# EAGLE design 2019wimarc (EAGLE 7.2.0)
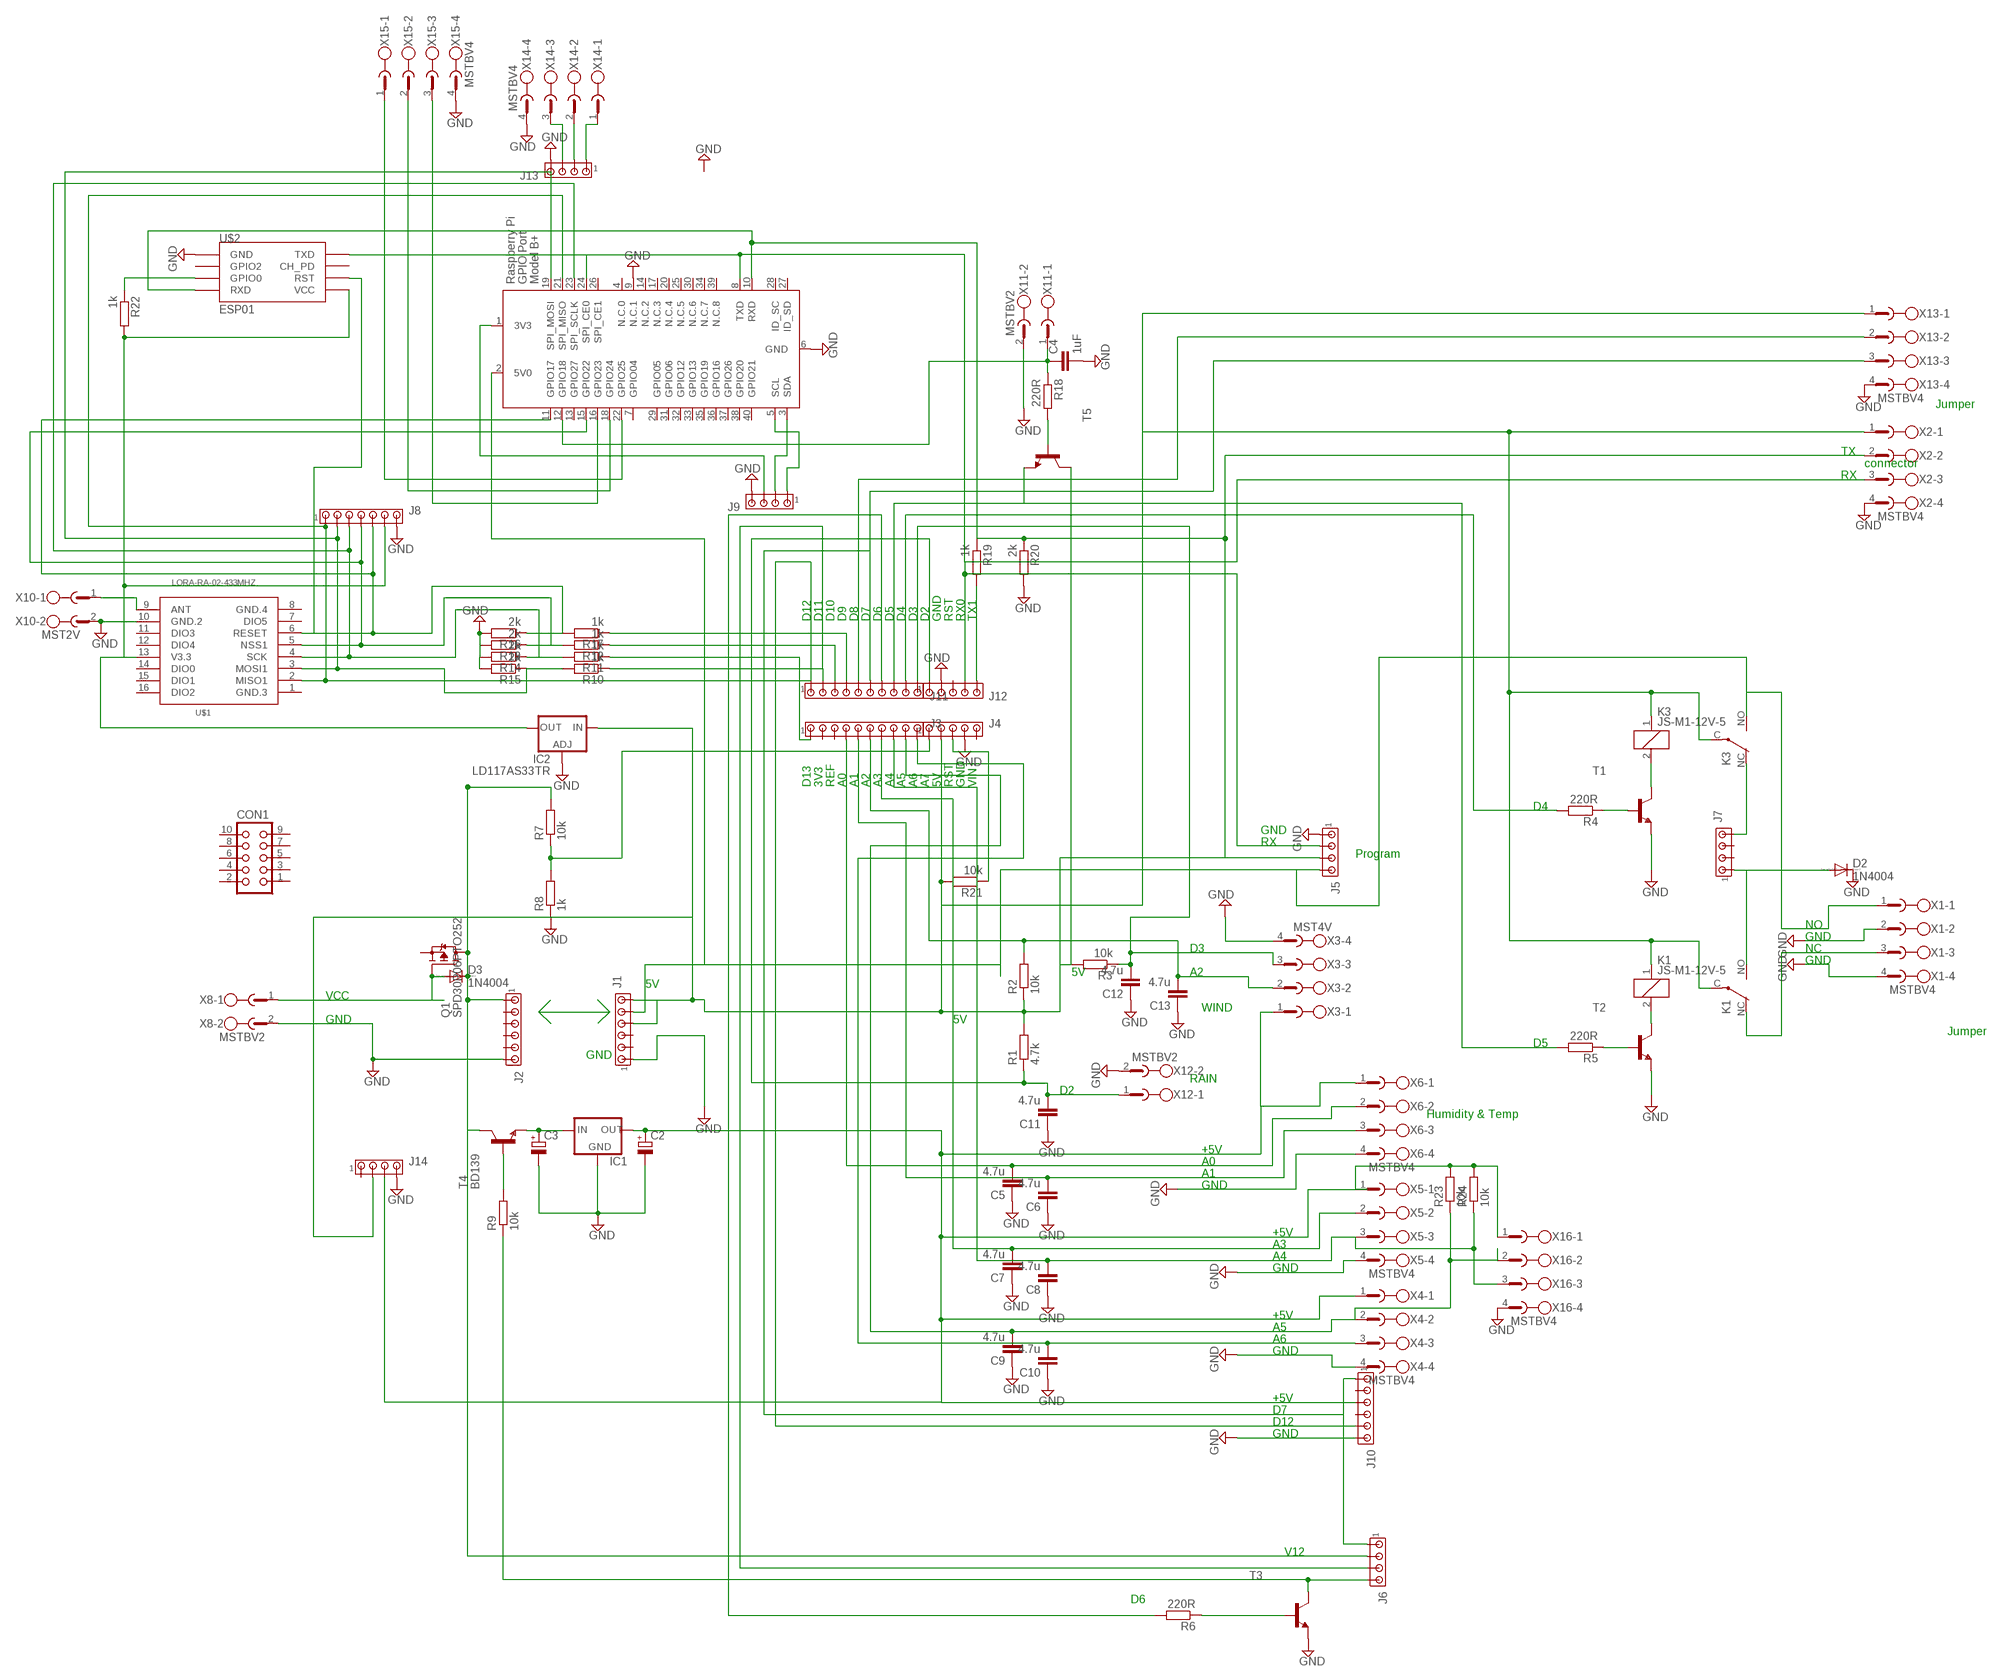
[diagram p0: schematic, sheet 1]

## Parts
C2  CPOL-EUE2.5-7  [E2,5-7]
C3  CPOL-EUE2.5-7  [E2,5-7]
C4  1uF  C-EUC0805K  [C0805K]
C5  4.7u  C-EUC0805K  [C0805K]
C6  4.7u  C-EUC0805K  [C0805K]
C7  4.7u  C-EUC0805K  [C0805K]
C8  4.7u  C-EUC0805K  [C0805K]
C9  4.7u  C-EUC0805K  [C0805K]
C10  4.7u  C-EUC0805K  [C0805K]
C11  4.7u  C-EUC0805K  [C0805K]
C12  4.7u  C-EUC0805K  [C0805K]
C13  4.7u  C-EUC0805K  [C0805K]
CON1  CON10  [CON10]
D2  1N4004  [DO41-10]
D3  1N4004  [DO41-10]
IC1  78XXL  [78XXL]
IC2  LD117AS33TR  [SOT223]
J1  MTA06-100  [10X06MTA]
J2  MTA06-100  [10X06MTA]
J3  MTA10-100  [10X10MTA]
J4  MTA05-100  [10X05MTA]
J5  MTA04-100  [10X04MTA]
J6  MTA04-100  [10X04MTA]
J7  MTA04-100  [10X04MTA]
J8  MTA07-100  [10X07MTA]
J9  MTA04-100  [10X04MTA]
J10  MTA06-100  [10X06MTA]
J11  MTA10-100  [10X10MTA]
J12  MTA05-100  [10X05MTA]
J13  MTA04-100  [10X04MTA]
J14  MTA04-100  [10X04MTA]
K1  JS-M1-12V-5  [JS-M]
K3  JS-M1-12V-5  [JS-M]
Q1  SPD30P06PTO252  [TO252]
R1  4.7k  R-EU_M0805  [M0805]
R2  10k  R-EU_M0805  [M0805]
R3  10k  R-EU_M0805  [M0805]
R4  220R  R-EU_M0805  [M0805]
R5  220R  R-EU_M0805  [M0805]
R6  220R  R-EU_M0805  [M0805]
R7  10k  R-EU_M0805  [M0805]
R8  1k  R-EU_M0805  [M0805]
R9  10k  R-EU_M0805  [M0805]
R10  1k  R-EU_M0805  [M0805]
R11  1k  R-EU_M0805  [M0805]
R12  1k  R-EU_M0805  [M0805]
R13  2k  R-EU_M0805  [M0805]
R14  2k  R-EU_M0805  [M0805]
R15  2k  R-EU_M0805  [M0805]
R16  2k  R-EU_M0805  [M0805]
R17  1k  R-EU_M0805  [M0805]
R18  220R  R-EU_M0805  [M0805]
R19  1k  R-EU_M0805  [M0805]
R20  2k  R-EU_M0805  [M0805]
R21  10k  R-EU_M0805  [M0805]
R22  1k  R-EU_M0805  [M0805]
R23  10k  R-EU_M0805  [M0805]
R24  10k  R-EU_M0805  [M0805]
T1  -NPN-SOT89-BCE  [SOT89-BCE]
T2  -NPN-SOT89-BCE  [SOT89-BCE]
T3  -NPN-SOT89-BCE  [SOT89-BCE]
T4  BD139  [TO126]
T5  -NPN-SOT89-BCE  [SOT89-BCE]
U$1  LORA-RA-02-433MHZ  [LORA-RA2-SMD]
U$2  ESP01  [ESP01]
X1  MSTBV4  [MSTBV4]
X2  MSTBV4  [MSTBV4]
X3  MST4V  [MSTBV4]
X4  MSTBV4  [MSTBV4]
X5  MSTBV4  [MSTBV4]
X6  MSTBV4  [MSTBV4]
X8  MSTBV2  [MSTBV2]
X9  RASPI_BOARD_B+_F  [RASPI_BOARD_B+_FULL]
X10  MST2V  [MSTBV2]
X11  MSTBV2  [MSTBV2]
X12  MSTBV2  [MSTBV2]
X13  MSTBV4  [MSTBV4]
X14  MSTBV4  [MSTBV4]
X15  MSTBV4  [MSTBV4]
X16  MSTBV4  [MSTBV4]

## Nets
GND: C2.- C3.- C4.2 C5.1 C6.1 C7.1 C8.1 C9.1 C10.1 C11.1 C12.1 C13.1 D2.C IC1.GND IC2.1(ADJ) J1.1 J2.6 J4.4 J5.1 J8.7 J9.4 J10.6 J12.2 J13.4 J14.4 R8.1 R13.2 R14.2 R15.2 R16.2 R20.2 T1.E T2.E T3.E U$1.10(GND.2) U$2.GND X1.2 X1.4 X2.4 X3.4 X4.4 X5.4 X6.4 X8.2 X9.6(GND) X9.9(N.C.1) X10.2 X11.2 X12.2 X13.4 X14.4 X15.4 X16.4
N$1: C5.2 J3.4 X6.2
N$2: C11.2 J12.1 R1.1 X12.1
N$3: C12.2 J11.10 R3.1 X3.3
N$4: C13.2 J3.6 R2.2 X3.2
N$5: J7.4 K3.NC(2:O)
N$6: J3.1 R11.1
N$7: D3.A Q1.1(G) X8.1
N$8: R19.1 R20.1 U$2.RX(RXD) X2.2 X9.10(RXD)
N$9: J5.2 J12.4 U$2.TX(TXD) X2.3 X9.8(TXD)
N$10: J13.1 X14.1
N$11: J11.3 R12.1
N$12: D3.C J2.1 J6.2 Q1.3(D) R7.2 T4.2(C)
N$13: C6.2 J3.5 X6.3
N$14: C7.2 J3.7 X5.2
N$15: C8.2 J3.8 R24.1 X5.3 X16.3
N$17: C10.2 J3.10 X4.3
N$18: J11.6 X13.3
N$19: J8.1 J10.5 J11.1 U$1.2(MISO1) X9.21(SPI_MISO)
N$20: K3.2 T1.C
N$21: X9.22(GPIO25) X15.1
N$22: R4.1 T1.B
N$23: K1.2 T2.C
N$24: R5.1 T2.B
N$25: K1.NC(2:O) X1.3
N$26: J6.4 R9.1 T3.C
N$28: C2.+ IC1.OUT J10.3 J14.3 R23.2 R24.2 X3.1 X4.1 X5.1 X6.1 X16.1
N$29: J4.1 R7.1 R8.2
N$30: R6.1 T3.B
N$31: J11.9 R4.2
N$32: J11.8 R5.2 T5.E
N$33: J11.7 R6.2
N$34: J6.1 J10.1
N$35: J8.3 R11.2 R14.1 U$1.4(SCK) X9.23(SPI_SCLK)
N$36: D2.A J7.1 K1.NO(2:S)
N$37: R18.2 T5.B
N$38: C3.+ IC1.IN T4.1(E)
N$39: R9.2 T4.3(B)
N$40: J11.5 X13.2
N$41: X9.18(GPIO24) X15.2
N$42: J8.5 R16.1 R17.2 U$1.6(RESET) U$2.RST X9.11(GPIO17)
N$44: J8.2 R10.2 R15.1 U$1.3(MOSI1) X9.19(SPI_MOSI)
N$45: J11.4 R17.1
N$46: C4.1 R18.1 X9.12(GPIO18) X11.1
N$47: U$1.9(ANT) X10.1
N$48: J8.4 R12.2 R13.1 U$1.5(NSS1) X9.15(GPIO22)
N$49: J12.5 R19.2
N$50: J4.3 R21.1
N$51: J9.2 X9.3(SDA)
N$52: J9.1 X9.5(SCL)
N$53: IC2.4(OUT) J8.6 R22.2 U$1.13(V3.3) U$2.VCC
N$54: IC2.3(IN) J1.4 J1.6 J4.2 J5.3 J14.2 K1.1 K1.C(2:P) K3.1 K3.C(2:P) R1.2 R2.1 R3.2 R21.2 T5.C X2.1 X13.1
N$55: J13.2 X14.2
N$56: J13.3 X14.3
N$57: X9.24(SPI_CE0)
N$59: X9.16(GPIO23) X15.3
N$61: J6.3 J11.2 R10.1
N$62: J9.3 X9.1(3V3)
N$63: R22.1 U$2.GPIO0
N$64: C9.2 J3.9 R23.1 X4.2 X16.2
N$70: J1.5 J5.4 K3.NO(2:S) X1.1 X9.2(5V0)
Unconnected: CON1.1 CON1.2 CON1.3 CON1.4 CON1.5 CON1.6 CON1.7 CON1.8 CON1.9 CON1.10 J1.2 J1.3 J2.2 J2.3 J2.4 J2.5 J3.2 J3.3 J4.5 J7.2 J7.3 J10.2 J10.4 J12.3 J14.1 Q1.2(S) U$1.7(DIO5) U$1.12(DIO4) U$1.14(DIO0) U$1.15(DIO1) U$1.16(DIO2) U$2.CH_PD U$2.GPIO2 X9.4(N.C.0) X9.7(GPIO04) X9.13(GPIO27) X9.14(N.C.2) X9.17(N.C.3) X9.20(N.C.4) X9.25(N.C.5) X9.26(SPI_CE1) X9.27(ID_SD) X9.28(ID_SC) X9.29(GPIO05) X9.30(N.C.6) X9.31(GPIO06) X9.32(GPIO12) X9.33(GPIO13) X9.34(N.C.7) X9.35(GPIO19) X9.36(GPIO16) X9.37(GPIO26) X9.38(GPIO20) X9.39(N.C.8) X9.40(GPIO21)

## Notes on the sheet
- Jumper
- TX
- connector
- RX
- D12 | D11 | D10 | D9 | D8 | D7 | D6 | D5 | D4 | D3 | D2 | GND | RST | RX0 | TX1
- D13 | 3V3 | REF | A0 | A1 | A2 | A3 | A4 | A5 | A6 | A7 | 5V | RST | GND | VIN
- D4
- GND
- RX
- Program
- NO
- GND
- D3 | NC
- GND
- 5V | A2
- 5V
- VCC
- WIND
- GND | 5V
- Jumper
- D5
- GND
- RAIN
- D2
- Humidity & Temp
- +5V
- A0
- A1
- GND
- +5V
- A3
- A4
- GND
- +5V
- A5
- A6
- GND
- +5V
- D7
- D12
- GND
- V12
- D6

## Power pins joined to a net without a drawn wire
DIO3: U$1.11(DIO3)
GND.3: U$1.1(GND.3)
GND.4: U$1.8(GND.4)

## Library data of the parts
C2 C3 = rcl:CPOL-EU: POLARIZED CAPACITOR, European symbol
C4-C13 = rcl:C-EU: CAPACITOR, European symbol
CON1 = con-harting:CON10: CONNECTOR; OC_FARNELL: unknown; OC_NEWARK: unknown
D2 D3 = diode:1N4004: DIODE general purpose rectifier, 1 A
IC1 = v-reg:78XXL: VOLTAGE REGULATOR
IC2 = v-reg:LD117A?*: Low drop fixed and adjustable positive voltage regulators 1 A Source: http://www.st.com/stonline/products/literature/ds/7194/ld1117axx.pdf
J1 J2 J10 = con-amp:MTA06-100: AMP connector Connection corrected 2014-09-19
J3 J11 = con-amp:MTA10-100: AMP connector
J4 J12 = con-amp:MTA05-100: AMP connector
J5-J7 J9 J13 J14 = con-amp:MTA04-100: AMP connector
J8 = con-amp:MTA07-100: AMP connector
K1 K3 = relay:JS-M1*: Automotive Ultra-Miniature Power Relay NAiS Source: http://www.mew-europe.com/.. en_ds_61211_0000.pdf
Q1 = transistor-fet:SPD30P06P: SIPMOS(R) Power-Transistor P-Channel, Enhancement mode Source: http://www.infineon.com/upload/Document/cmc_upload/documents/012/3615/SPD_U30P06P.pdf
R1-R24 = resistor:R-EU_: RESISTOR, European symbol
T1-T3 T5 = transistorSMD:*-NPN-: NPN Transistror BF959 corrected 2008.03.06
T4 = transistor-npn:BD139*: NPN Transistor
U$1 = LikeCircuit:LORA-RA-02-433MHZ: 433 MHz Lora Ra-02 Radio Transceiver Module based on SX1276 chip. Visit our more eagle PCB <https://www.likecircuit.com/>
U$2 = esp8266modules:ESP01: ESP8266 Wifi module 01
X1 X2 X4-X6 X13-X16 = con-phoenix-508:MSTBV4: PHOENIX; MPN: MSTBV 2,5/4-GF-5.08; OC_FARNELL: 1792794; OC_NEWARK: 69R9847
X3 = con-phoenix-508:MST4V: PHOENIX; OC_FARNELL: unknown; OC_NEWARK: unknown
X8 X11 X12 = con-phoenix-508:MSTBV2: PHOENIX; MPN: MSTBV 2,5/2-GF-5.08; OC_FARNELL: 1792792; OC_NEWARK: 69R9845
X9 = raspberrypi_bastelstube_v13:RASPI_BOARD_B+: Raspberry Pi GPIO connector with markings for the outer dimensions of the Raspberry Pi board model B+ with different sets of drill holes or mounting pads
X10 = con-phoenix-508:MST2V: PHOENIX; OC_FARNELL: unknown; OC_NEWARK: unknown

## Board
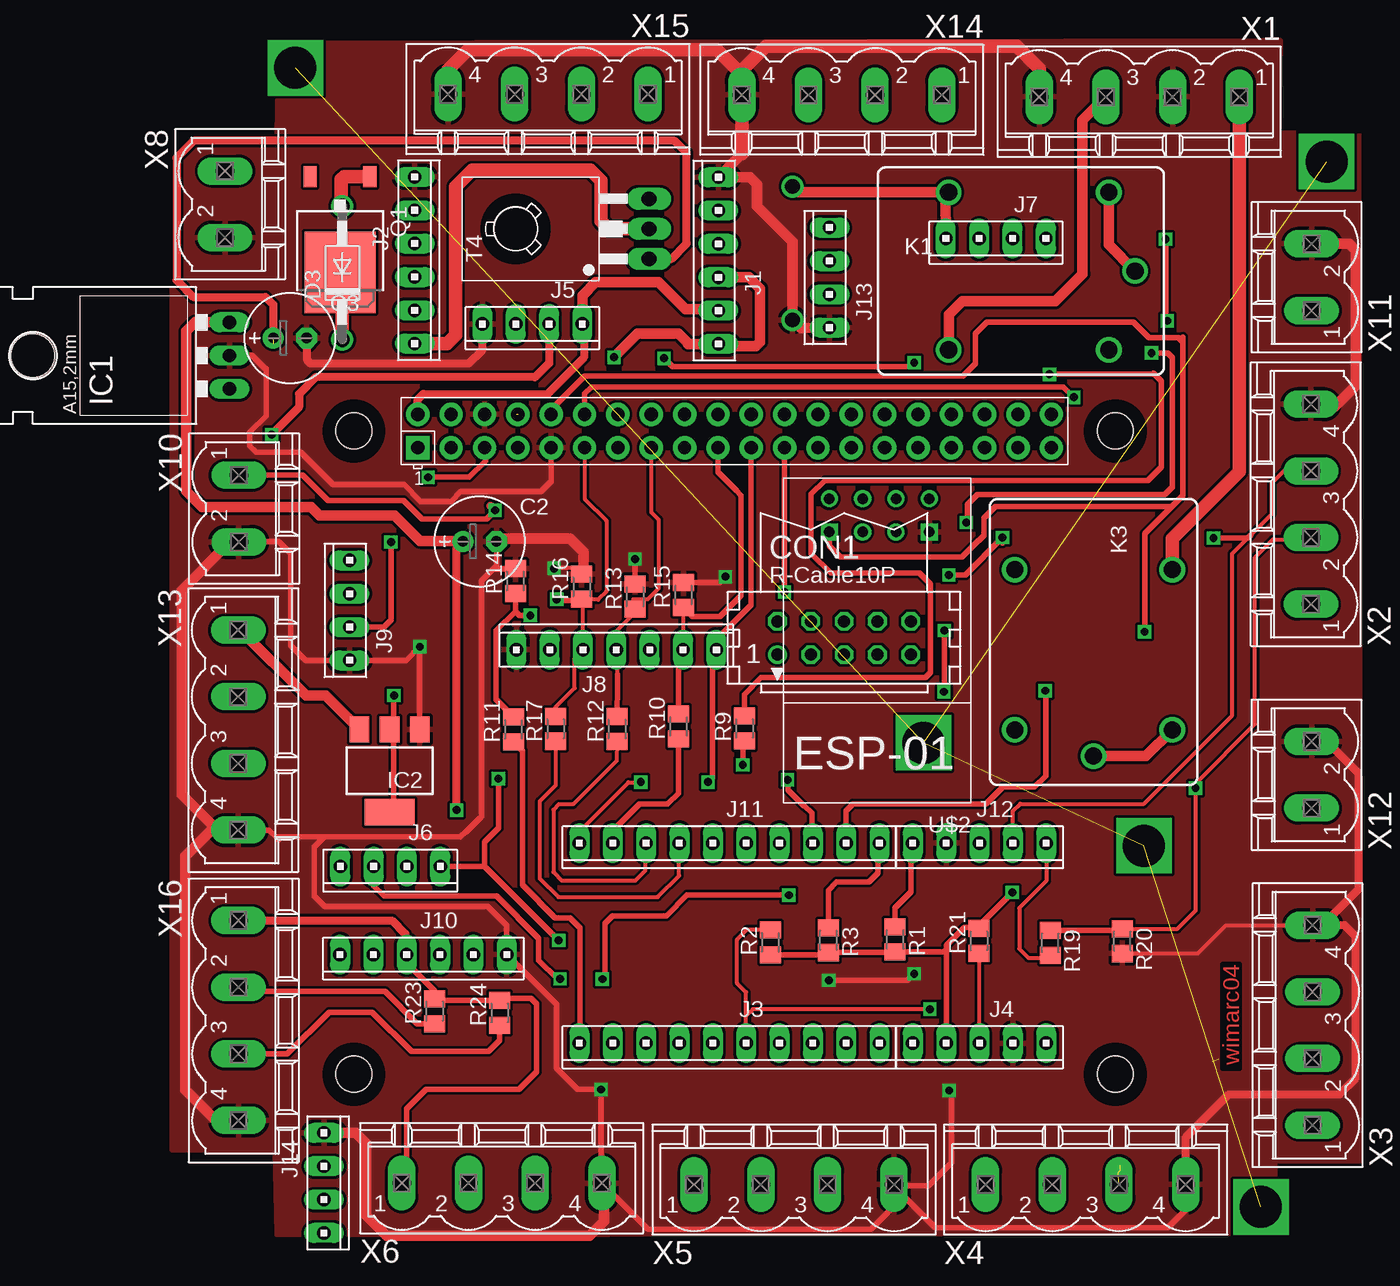
[diagram p1: board, top side]
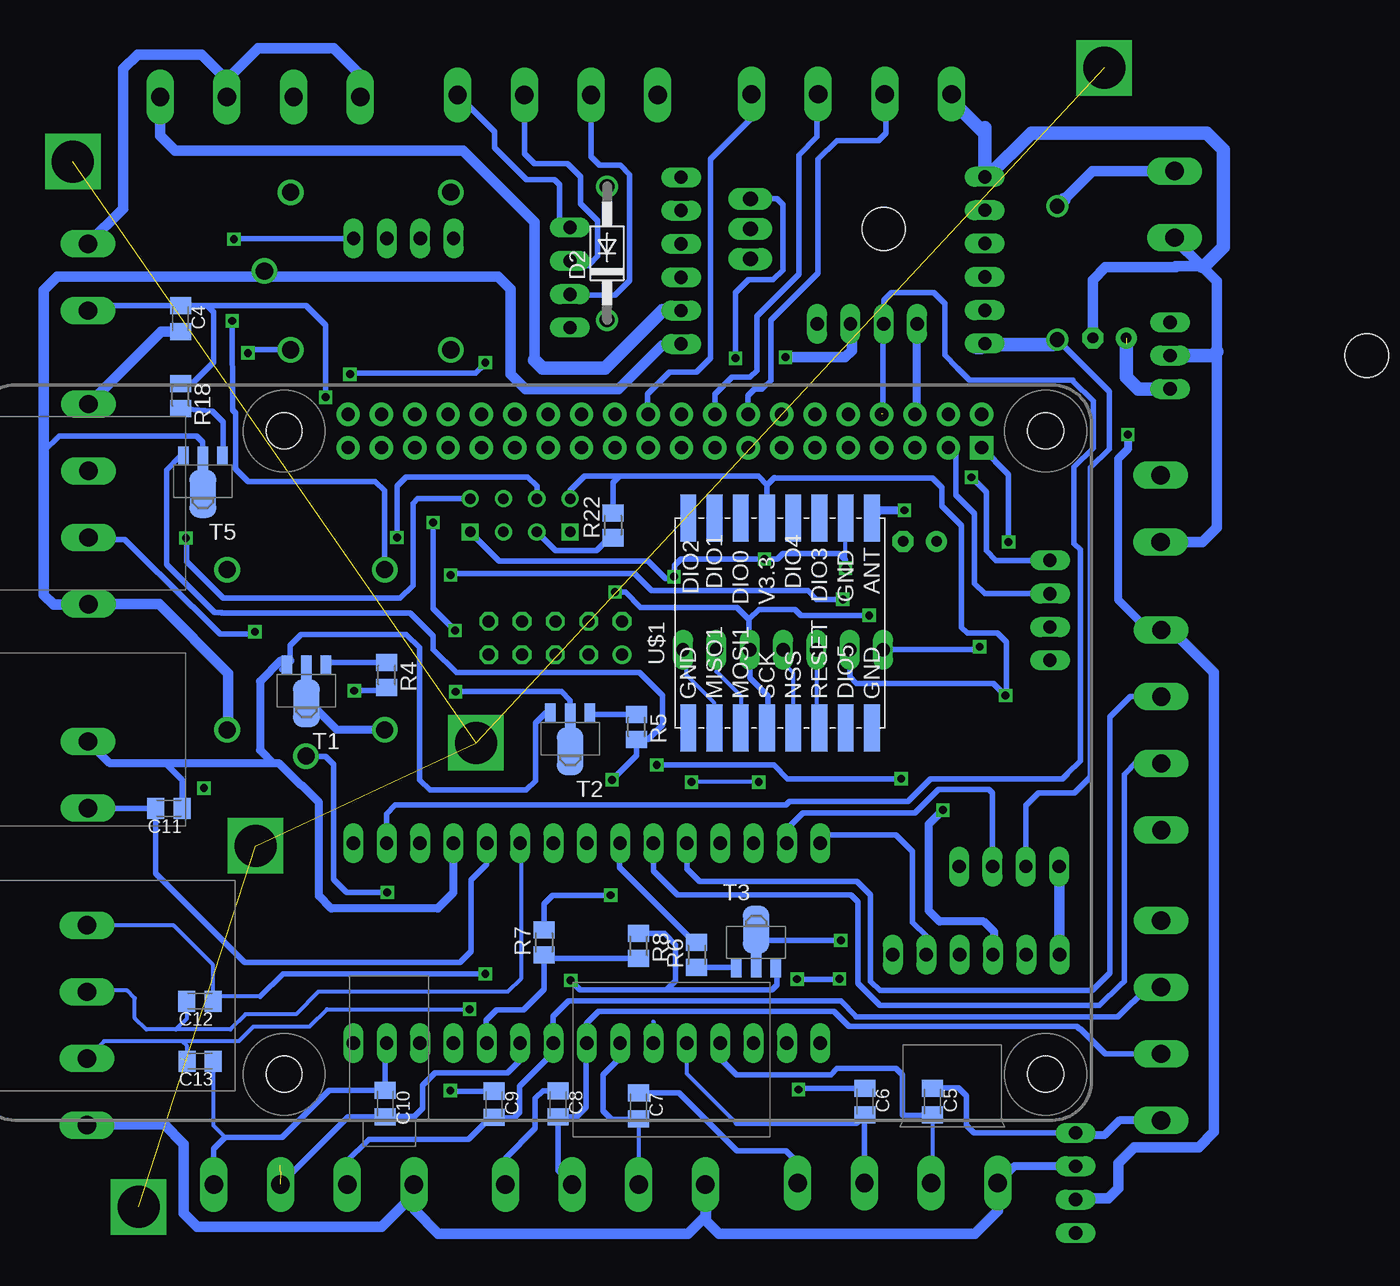
[diagram p2: board, bottom side, seen from below]

No outline drawn. Coordinates in mm, seen from the top.
Copper layers (1*16): Top 0.035mm / dielectric 1.5mm / Bottom 0.035mm
Design rules "default": minimum track width 10mil, minimum drill 24mil, track to track 8mil, track to pad 8mil, pad to pad 8mil, via to via 8mil, smd to smd 8mil, copper to edge 40mil, drill to drill 8mil, minimum pad ring 10mil, minimum via ring 8mil, stop-mask expansion 4mil, vias tented up to drill 0mil, thermal gap 10mil

### Footprints (pad centres in the part's own frame; a part is rotated, then mirrored left to right if it is on the bottom)
E2,5-7 = drill 0.813 pad 1.6: + -1.27,0 | drill 0.813 pad 1.6 octagon: - 1.27,0
C0805K = smd 1.3 x 1.6: 1 -1,0; 2 1,0
CON10 = drill 0.914: 1 -5.08,-1.27 | drill 0.914 octagon: 2 -5.08,1.27; 3 -2.54,-1.27; 4 -2.54,1.27; 5 0,-1.27; 6 0,1.27; 7 2.54,-1.27; 8 2.54,1.27; 9 5.08,-1.27; 10 5.08,1.27
DO41-10 = drill 1.118: A 5.08,0; C -5.08,0
78XXL = drill 1.016 long: GND 0,-3.81; IN -2.54,-3.81; OUT 2.54,-3.81 | hole 3.302: 0,11.176
SOT223 = smd 1.5 x 2: 1 -2.3,-3.15; 2 0,-3.15; 3 2.3,-3.15 | smd 3.8 x 2: 4 0,3.15
10X06MTA = drill 1.016 long: 1 6.35,0; 2 3.81,0; 3 1.27,0; 4 -1.27,0; 5 -3.81,0; 6 -6.35,0
10X10MTA = drill 1.016 long: 1 11.43,0; 2 8.89,0; 3 6.35,0; 4 3.81,0; 5 1.27,0; 6 -1.27,0; 7 -3.81,0; 8 -6.35,0; 9 -8.89,0; 10 -11.43,0
10X05MTA = drill 1.016 long: 1 5.08,0; 2 2.54,0; 3 0,0; 4 -2.54,0; 5 -5.08,0
10X04MTA = drill 1.016 long: 1 3.81,0; 2 1.27,0; 3 -1.27,0; 4 -3.81,0
10X07MTA = drill 1.016 long: 1 7.62,0; 2 5.08,0; 3 2.54,0; 4 0,0; 5 -2.54,0; 6 -5.08,0; 7 -7.62,0
JS-M = drill 1.3: 1 6.7,6; 2 6.7,-6; C 8.7,0; NC -5.5,-6; NO -5.5,6
TO252 = smd 1 x 1.6: 1 -2.28,-4.8; 2 2.28,-4.8 | smd 5.4 x 6.2: 3 0,2.5
M0805 = smd 1.3 x 1.6: 1 -0.95,0; 2 0.95,0
SOT89-BCE = smd 0.8 x 1.4: B -1.499,-1.981; E 1.499,-1.981 | smd 0.8 x 1.9: C 0,-1.727 | smd 2.032 x 3.65: C@1 0,0.94
TO126 = drill 1.118 long: 1 -2.286,-5.08; 2 0,-5.08; 3 2.286,-5.08 | hole 3.302: 0,5.08
LORA-RA2-SMD = smd 3.6 x 1.2: 1 -8,7; 2 -8,5; 3 -8,3; 4 -8,1; 5 -8,-1; 6 -8,-3; 7 -8,-5; 8 -8,-7; 9 8,-7; 10 8,-5; 11 8,-3; 12 8,-1; 13 8,1; 14 8,3; 15 8,5; 16 8,7
ESP01 = drill 0.8: CH_PD -1.285,-8.178; GPIO0 1.255,-5.638; GPIO2 -1.285,-5.638; RST 1.255,-8.178; TX -3.825,-8.178; VCC 3.795,-8.178 | drill 0.8 square: GND -3.825,-5.638; RX 3.795,-5.638
MSTBV4 = drill 1.397 long: 1 -7.62,0; 2 -2.54,0; 3 2.54,0; 4 7.62,0
MSTBV2 = drill 1.397 long: 1 -2.54,0; 2 2.54,0
RASPI_BOARD_B+_FULL = drill 1 pad 1.778 square: 1 8.37,51.23 | drill 1 pad 1.778: 2 8.37,53.77; 3 10.91,51.23; 4 10.91,53.77; 5 13.45,51.23; 6 13.45,53.77; 7 15.99,51.23; 8 15.99,53.77; 9 18.53,51.23; 10 18.53,53.77; 11 21.07,51.23; 12 21.07,53.77; 13 23.61,51.23; 14 23.61,53.77; 15 26.15,51.23; 16 26.15,53.77; 17 28.69,51.23; 18 28.69,53.77; 19 31.23,51.23; 20 31.23,53.77; 21 33.77,51.23; 22 33.77,53.77; 23 36.31,51.23; 24 36.31,53.77; 25 38.85,51.23; 26 38.85,53.77; 27 41.39,51.23; 28 41.39,53.77; 29 43.93,51.23; 30 43.93,53.77; 31 46.47,51.23; 32 46.47,53.77; 33 49.01,51.23; 34 49.01,53.77; 35 51.55,51.23; 36 51.55,53.77; 37 54.09,51.23; 38 54.09,53.77; 39 56.63,51.23; 40 56.63,53.77 | hole 2.75: 3.5,3.5; 3.5,52.5; 61.5,3.5; 61.5,52.5

### Placement (x,y rotation side)
C2  24.43,59.13 0 top
C3  9.98,74.63 0 top
C4  80.75,76.1 270 bottom
C5  23.47,16.46 270 bottom
C6  28.63,16.46 270 bottom
C7  45.87,16.13 270 bottom
C8  51.99,16.28 270 bottom
C9  56.87,16.26 270 bottom
C10  65.15,16.31 270 bottom
C11  81.64,38.79 180 bottom
C12  79.27,24.1 180 bottom
C13  79.25,19.53 180 bottom
CON1  52.2,51.77 0 top
D2  48.26,81.08 90 bottom
D3  13.97,79.58 90 top
IC1  1.57,73.28 90 top
IC2  17.58,41.66 180 top
J1  42.62,80.52 90 top
J2  19.48,80.54 270 top
J3  43.46,20.9 180 top
J4  62.51,20.9 180 top
J5  28.45,75.68 180 top
J6  17.63,34.37 180 top
J7  63.75,82.19 180 top
J8  34.85,50.88 0 top
J9  14.53,53.87 90 top
J10  20.14,27.66 180 top
J11  43.46,36.14 180 top
J12  62.51,36.14 180 top
J13  51.08,79.22 90 top
J14  12.57,10.26 270 top
K1  65.66,79.72 0 top
K3  71.19,51.47 270 top
Q1  13.79,82.12 180 top
R1  56.08,28.81 270 top
R2  46.57,28.59 90 top
R3  51,28.75 270 top
R4  65.04,48.95 270 bottom
R5  46.01,45 270 bottom
R6  41.43,27.62 90 bottom
R7  53.06,28.57 90 bottom
R8  45.85,28.32 270 bottom
R9  44.6,44.88 90 top
R10  39.57,45.03 90 top
R11  27,44.81 90 top
R12  34.9,44.83 90 top
R13  36.27,54.91 90 top
R14  27.15,56.11 90 top
R15  39.95,55.04 90 top
R16  32.21,55.68 90 top
R17  30.23,44.86 90 top
R18  80.75,70.18 270 bottom
R19  67.89,28.55 270 top
R20  73.38,28.68 270 top
R21  62.46,28.7 90 top
R22  47.8,60.35 90 bottom
R23  21.01,23.34 90 top
R24  25.96,23.22 90 top
T1  71.16,47.74 180 bottom
T2  51.07,44.09 180 bottom
T3  36.91,28.6 0 bottom
T4  32.26,82.93 90 top
T5  79.04,63.68 180 bottom
U$1  35.08,52.91 90 bottom
U$2  54.86,54.2 180 top
X1  74.68,92.98 180 top
X2  87.75,61.96 90 top
X3  87.88,22.28 90 top
X4  70.59,10.15 0 top
X5  48.39,10.15 0 top
X6  26.12,10.25 0 top
X8  5.04,84.8 270 top
X9  11.35,15.04 0 top
X10  6.1,61.62 270 top
X11  87.81,79.25 90 top
X12  87.81,41.35 90 top
X13  6.05,44.75 270 top
X14  52.02,93.14 180 top
X15  29.64,93.19 180 top
X16  6.07,22.63 270 top

### Tracks (layer width: path | path; a pad name or v marks a point on that pad's centre or on a via)
GND  (via drill 0.6)
  Top 0.305: R20.2 79.14,27.73 81.28,29.87 87.86,29.87 X3.4 87.78,30 | 32.36,57.08 30.11,57.08 v30.1,57.07
  Top 0.406: IC2.1 v19.88,51.1 | 27.04,56.95 27.12,57.02 | v19.88,51.1 18.84,50.06 J9.4 11.18,50.06 10.03,51.21 10.03,58.19 9.12,59.11 6.12,59.11 X10.2 | 27.12,57.02 R14.2 | 65.15,20.8 J4.4 | v60.2,17.3 60.35,17.14 60.35,11.81 58.6,10.06 56.1,10.06 X5.4 56.01,8.48 54.25,6.73 37.26,6.73 X6.4 33.68,10.31 v33.68,17.37 33.66,17.4 31.88,17.4 30.3,18.97 30.3,23.85 J10.6 26.49,29.87 25.04,31.32 12.62,31.32 11.84,32.11 11.84,35.84 12.6,36.6 | v51.03,25.68 57.02,25.68 v57.53,26.19 | 19.89,51.12 v19.88,51.1 | 9.12,36.4 8.91,36.6 | 5.74,37.11 5.74,37.19 5.82,37.11 8.41,37.11 8.91,36.6 | 27.12,57.02 25.45,57.02 | 25.45,57.02 24.56,56.13 24.56,38.18 23.39,37.01 23.37,37.01 22.96,36.6 12.6,36.6 | 12.6,36.6 8.91,36.6 | X5.4 56.01,10.01 59.16,6.86 76.86,6.86 78.28,8.28 78.28,10.08 X4.4 | C2.- 25.7,57.28 25.45,57.02 | 32.36,57.08 R16.2 | R15.2 42.71,55.99 v43.16,56.44 | R13.2 v36.27,57.78 | X9.9 29.88,63.69 29.11,62.92 22.99,62.92 22.25,62.18 19.94,62.18 18.67,63.45 13.26,63.45 10.79,65.91 7.39,65.91 6.93,66.37 6.93,67.44 8.18,68.68 8.18,72.29 8.08,72.29 7.06,73.3 5.41,73.3 IC1.GND
  Top 0.61: 24.64,74.78 J5.1 24.64,73.71 23.6,72.67 11.56,72.67 11.3,72.92 11.3,74.57 C3.- | X4.4 78.21,13.72 81.48,16.99 89.92,16.99 91.16,18.24 91.16,29.06 90.32,29.9 X3.4 | 87.78,30 88.75,30 91.39,32.64 91.39,41.45 89.1,43.74 87.96,43.74 X12.2
  Top 0.813: 87.76,69.57 X2.4 87.94,69.39 89.59,69.39 91.19,70.99 91.19,81.28 90.68,81.79 X11.2 | 44.4,88.65 J1.1 45.03,86.87 45.57,86.33 45.57,84.66 48.26,81.97 D2.C 48.9,75.36 J13.4 | J14.4 14.99,14.07 15.77,13.28 15.77,7.8 17.35,6.22 32.79,6.22 33.91,7.34 33.91,10.08 X6.4 | X13.4 4.01,37.13 2.01,35.13 2.01,17.35 4.7,14.66 5.71,14.66 X16.4 | 5.74,37.11 4.47,37.11 1.73,39.85 1.73,55.4 5.41,59.08 X10.2 | 32.36,57.08 32.36,58.32 31.32,59.36 25.93,59.36 C2.-
  Top 1.016: 44.4,94.69 X14.4 44.4,88.65 | 44.4,94.69 44.4,95.02 46.23,96.85 65.35,96.85 67.06,95.15 X1.4 | X15.4 22.02,95.07 23.55,96.6 42.49,96.6 44.4,94.69
  Bottom 0.305: 74.68,24.46 77.92,24.46 C12.1 78.27,26.86 81.28,29.87 87.86,29.87 X3.4 | 77.35,13.74 78.25,14.64 C13.1 | v30.1,57.07 30.1,57.71 30.1,60.89 U$1.10
  Bottom 0.406: J8.7 20.11,50.88 v19.88,51.1 | T1.E 73,49.38 73.05,49.38 72.39,50.04 72.39,51.21 71.55,52.05 63.55,52.05 62.53,51.03 62.53,40.97 61.75,40.18 54.43,40.18 53.72,40.89 53.72,45.31 52.96,46.08 T2.E | 43.71,24.97 50.32,24.97 v51.03,25.68 | C6.1 33.59,17.46 v33.68,17.37 | C8.1 53.15,17.28 53.75,16.69 53.75,14.4 56.01,12.14 X5.4 | J4.4 65.15,20.8 C10.1 69.43,17.31 73,13.74 77.35,13.74 78.21,12.88 X4.4 | C9.1 60.16,17.26 v60.2,17.3 | C7.1 42.78,17.13 38.35,12.7 34.62,12.7 33.68,11.76 33.68,10.31 X6.4 | C5.1 23.43,17.5 21.49,17.5 20.88,16.89 20.88,14.63 20.32,14.07 J14.4 | v57.53,26.19 72.95,26.19 74.68,24.46 | R8.1 43.9,29.27 43.03,28.4 43.03,25.65 43.71,24.97 | 43.71,24.97 35.71,24.97 35.33,25.35 35.33,26.54 T3.E | 1.93,76.1 1.83,76.2 | 24.64,68.97 X9.6 | C11.1 80.64,40.96 81.89,42.22 | U$2.GND 56.48,57.63 45.14,57.63 43.81,56.31 43.28,56.31 v43.16,56.44 43.1,56.49 43.1,57.3 42.62,57.78 v36.27,57.78 35.28,57.78 34.85,58.22 30.61,58.22 30.1,57.71
  Bottom 0.61: 73.69,42.22 73.25,42.22 71.58,40.54 71.5,40.54 70.21,39.24 70.21,32.11 69.27,31.17 61.16,31.17 59.97,32.36 J12.2 | 73.69,42.22 81.89,42.22 86.13,42.22 X12.2 | 72.39,50.04 73.13,50.04 74.7,48.46 74.7,43.23 73.69,42.22 | X16.4 9.25,15.01 10.36,13.89 12.39,13.89 J14.4 | 24.64,68.97 J5.1
  Bottom 0.813: C4.2 82.23,75.1 X2.4 | 2.97,80.09 1.83,78.94 1.83,76.2 1.83,73.58 1.83,60.17 2.92,59.08 X10.2 | X1.2 77.22,94.31 | 77.22,94.31 79.12,96.22 84.02,96.22 85.11,95.12 85.11,84.48 X11.2 | X1.4 67.06,94.67 69.09,96.7 74.83,96.7 77.22,94.31 | C3.- 11.25,79.05 10.29,80.01 4.93,80.01 4.93,80.09 2.97,80.09 | X8.2 5.04,82.15 2.97,80.09
  Bottom 1.016: 19.48,90.19 J2.6 19.28,86.89 15.95,90.22 2.59,90.22 1.32,88.95 1.32,81.53 2.77,80.09 2.97,80.09 | 19.48,90.19 19.48,90.65 | X15.4 22.02,92.73 19.48,90.19 | IC1.GND 2.13,73.28 1.83,73.58
  other vias: 56.01,10.15
  pour Top: 9.09,97.08 83.9,97.26 85.42,97.26 85.29,90.27 91.39,90.12 91.54,11.96 85.22,11.94 85.22,12.22 85.01,12.22 84.96,6.43 9.02,6.3 8.86,12.8 1.02,12.8 1.02,90.2 9.02,90.2 9.12,95.45
N$1  (via drill 0.6)
  Top 0.305: v23.47,10.36 X6.2
  Bottom 0.305: C5.2 v23.47,10.36
  Bottom 0.406: J3.4 39.65,19.74 38.41,18.49 31.22,18.49 30.73,18.97 26.24,18.97 25.76,18.49 25.76,15.44 25.73,15.42 23.43,15.42 C5.2
N$2  (via drill 0.6)
  Top 0.305: v87.78,38.79 X12.1
  Top 0.406: R1.1 56.08,31.19 57.3,32.41 57.3,36.02 J12.1
  Bottom 0.305: X12.1 87.05,38.81
  Bottom 0.406: J12.1 57.43,34.52 58.6,33.35 58.6,27.89 59.44,27.05 75.87,27.05 82.65,33.83 82.65,38.77 C11.2 v87.78,38.79
N$3
  Top 0.305: 54.84,36.09 J11.10 | 87.83,24.87 X3.3
  Top 0.406: R3.1 51,32.56 51.61,33.17 54.1,33.17 54.79,33.86 54.79,36.04 J11.10 | 87.66,24.59 X3.3
  Bottom 0.305: J11.10 54.79,36.04 54.79,25.86 55.8,24.84 55.8,24.82 70.26,24.82 71.96,23.11 75.79,23.11 76.96,21.95 81.1,21.95 | 87.83,24.87 X3.3 87.78,24.92 84.81,24.92 84.23,24.33 84.23,22.81 83.36,21.95 81.1,21.95 | C12.2 80.27,22.77 81.1,21.95
N$4  (via drill 0.6)  (1 unrouted)
  Top 0.305: J3.6 44.73,22.99 | 44.73,22.99 44.73,24.79 44.04,25.48 44.04,28.8 44.81,29.57 46.55,29.57 R2.2 | v58.73,23.5 45.24,23.5 44.73,22.99
  Bottom 0.305: 44.73,22.55 J3.6 | 80.72,19.71 80.75,19.74 | v58.73,23.5 69.6,23.5 70.94,22.15 75.21,22.15 76.3,21.06 80.62,21.06 | 80.62,21.06 86.56,21.06 X3.2 | C13.2 80.25,20.68 80.62,21.06
N$5  (via drill 0.6)
  Top 0.406: v76.68,82.14 76.71,76.02 v76.81,75.92
  Bottom 0.406: J7.4 76.63,82.19 v76.68,82.14 | v76.81,75.92 76.78,69.14 76.53,68.89 76.53,64.64 75.59,63.7 65.91,63.7 65.22,63.01 65.22,56.95 K3.NC
N$6
  Top 0.305: 32,20.93 J3.1
  Top 0.406: 31.98,20.95 J3.1 32.08,20.95 32.08,29.69 31.32,30.45 30.18,30.45 27.69,32.94 27.69,43.17 R11.1
N$7
  Top 1.016: Q1.1 14.1,86.92 13.89,86.72 13.89,84.73 D3.A
  Bottom 0.813: X8.1 11.28,87.34 D3.A
  Bottom 1.016: 13.47,85.16 D3.A
N$8  (via drill 0.6)
  Top 0.305: R20.1 77.58,29.63 78.97,31.01 78.97,40.28 | X2.2 87.61,59.28 84.86,59.28 83.49,57.91 83.49,45.21 78.97,40.69 v78.97,40.34
  Top 0.406: v78.97,40.34 78.97,40.28 | R19.1 73.25,29.5 R20.1 | 77.14,61.8 77.98,62.64 77.98,74.32 | 77.14,61.8 75.08,59.74 v75.08,52.25 74.98,52.35 | 77.98,74.7 77.98,74.32 | 77.98,74.32 77.65,74.65 75.39,74.65 74.22,75.82 71.55,75.82 71.53,75.84 63.07,75.84 62.18,74.95 62.18,72.67 61.24,71.73 32.44,71.73 29.88,69.18 X9.10 | U$2.RX 51.07,58.79 51.92,57.94 61.16,57.94 62.43,59.21 62.46,59.21 62.84,59.59 62.84,60.91 63.73,61.8 77.14,61.8
  Bottom 0.406: 78.92,40.28 v78.97,40.34 | X2.2 87.61,59.28 84.99,59.28 79.86,54.15 79.81,54.15 77.72,52.07 75.26,52.07 v75.08,52.25 | 29.72,68.97 X9.10
N$9  (via drill 0.6)  (1 unrouted)
  Top 0.305: J12.4 65.05,38.58 65.61,39.14 75.03,39.14 81.76,45.87 81.76,58.19 83.19,59.61 84.78,61.21 84.78,63.58 85.85,64.64 87.61,64.64 X2.3 87.76,64.52 88.49,64.52
  Top 0.406: v80.34,59.38 82.96,59.38 83.19,59.61
  Bottom 0.406: J12.4 65.05,38.38 64.39,39.04 34.65,39.04 34.37,39.32 25.32,39.32 23.62,41.02 13.56,41.02 13.18,41.4 13.18,41.45 12.22,42.42 12.22,58.5 12.7,58.98 12.7,64.77 11.23,66.24 11.23,69.8 12.78,71.35 12.78,71.42 20.68,71.42 21.57,72.31 21.57,72.34 22.53,73.3 22.53,77.24 23.37,78.08 26.59,78.08 27.18,77.49 J5.2 27.25,75.61 27.25,68.81 | J12.4 65.05,35.74 65.15,35.64 65.15,36.04 J12.4 | U$2.TX 62.69,62.38 63.04,62.03 63.04,55.78 64.01,54.81 77.5,54.81 80.29,57.61 80.29,59.33 v80.34,59.38
N$10
  Bottom 0.406: J13.1 51.87,83.01 51.87,86.31 52.25,86.69 54.41,86.69 56.84,89.13 56.84,90.35 X14.1
N$11
  Top 0.305: J11.3 37.06,36.09 37.06,34.06 36.3,33.3 30.68,33.3 30.05,33.93 30.05,38.68 30.45,39.09 31.55,39.09 34.87,42.42 R12.1
N$12  (via drill 0.6)
  Top 0.406: v47.98,32.18 40.23,32.18 38.66,30.61 34.54,30.61 33.98,30.05 33.98,25.98 v33.78,25.78 | v30.56,25.81 30.35,25.81 28.93,27.23 28.93,28.91 25.73,32.11 23.44,32.11 22.99,32.11 17.14,32.11 16.36,32.89 J6.2
  Top 1.016: J2.1 21.97,74.19 22.61,74.83 22.61,86.13 23.88,87.4 32.87,87.4 33.68,86.59 33.68,83.52 34.24,82.96 37.31,82.96 T4.2 37.29,82.98 | D3.C 13.97,79.44 Q1.3
  Bottom 0.406: 11.48,41.17 11.48,41.15 | 11.48,41.15 12.68,39.95 15.42,39.95 16.36,39.01 J6.2 | 11.48,41.15 11.43,41.2 11.43,64.75 10.01,66.17 10.01,70.54 D3.C | R7.2 53.06,31.52 52.43,32.16 48.01,32.16 v47.98,32.18 | v33.78,25.78 30.58,25.78 v30.56,25.81
  Bottom 1.016: J2.1 19.79,73.89 20.09,73.89 19.86,74.12 14.35,74.12 D3.C
N$13
  Top 0.305: 28.63,10.28 X6.3
  Bottom 0.305: J3.5 42.19,18.59 38.41,14.81 | 28.57,10.34 X6.3
  Bottom 0.406: 38.41,14.81 29.28,14.81 C6.2 28.63,15.34 28.65,15.32 X6.3
N$14  (via drill 0.6)
  Top 0.305: v45.87,10.17 X5.2
  Bottom 0.305: C7.2 v45.87,10.17
  Bottom 0.406: J3.7 47.27,19.79 48.56,18.49 48.56,15.75 47.93,15.11 45.89,15.11 C7.2
N$15
  Top 0.406: R24.1 25.96,21.11 25.12,20.27 19.25,20.27 16.26,23.27 12.95,23.27 9.78,20.09 X16.3
  Bottom 0.406: X16.3 10.31,20.09 12.22,22 12.29,22 12.47,22.17 29.82,22.17 30.99,23.34 48.92,23.34 49.84,22.43 49.84,20.93 J3.8 49.86,20.85 49.86,16 50.58,15.28 C8.2 51.99,11.21 X5.3
N$17  (3 unrouted)
  Bottom 0.406: J3.10 54.89,19.61 55.85,18.64 61.34,18.64 62.31,17.68 62.31,15.95 62.92,15.34 65.12,15.34 C10.2 68,15.28 X4.3
N$18
  Bottom 0.406: J11.6 44.73,34.04 42.88,32.18 29.67,32.18 29.16,31.67 29.16,25.45 27.48,23.77 10.74,23.77 9.17,25.35 9.14,25.35 8.87,25.63 8.87,41.38 7.85,42.39 6.22,42.39 X13.3
N$19  (via drill 0.6)
  Top 0.305: J11.1 32.03,37.03 35.76,40.77 36.68,40.77 v36.7,40.79 | 42.6,50.75 J8.1 42.16,50.57
  Top 0.406: 45.14,66.25 X9.21 45.11,66.25 45.11,54.28 42.47,51.64 J8.1 | 42.16,50.57 42.16,41.12 v41.83,40.79
  Bottom 0.305: v36.7,40.79 v41.83,40.79 | U$1.2 40.08,46.81 42.22,48.95 42.22,50.62 J8.1
  Bottom 0.406: 31.52,36.65 J11.1 31.42,36.75 26.24,36.75 24.99,35.51 24.99,30.12 23.95,29.08 J10.5
N$20
  Bottom 0.61: K3.2 68.82,44.77 71.14,47.09 71.14,49.45 T1.C
N$21
  Bottom 0.406: X15.1 37.26,91.36 40.39,88.24 40.39,73.1 41.45,72.03 43.48,72.03 45.16,70.36 45.16,68.84 X9.22
N$22
  Bottom 0.406: R4.1 69.48,49.9 T1.B
N$23  (via drill 0.6)
  Top 0.406: v75.62,73.48 76.83,73.48 77.19,73.13 77.19,63.25 77.17,63.25 76.61,62.69 62.33,62.69 61.57,61.92 61.57,60.5 v61.52,60.55 | v59.84,52.35 59.84,47.73 v59.79,47.68
  Bottom 0.406: K1.2 75.38,73.72 v75.62,73.48 | T2.C 51.07,47 51.74,47.68 v59.79,47.68 59.89,47.57 | v61.52,60.55 61.52,54.03 v59.84,52.35
N$24
  Bottom 0.406: R5.1 49.44,45.95 T2.B
N$25
  Top 0.813: K1.NC 60.16,76.39 61.19,77.42 68.28,77.42 70.36,79.5 70.36,91.2 X1.3
N$26  (via drill 0.6)
  Top 0.406: 24.82,34.37 v30.45,28.73 | 24.82,34.37 24.82,36.22 25.88,37.29 25.88,41.02 v25.86,41.05 | v44.48,42.09 44.48,43.8 R9.1 | 24.82,34.37 J6.4
  Bottom 0.406: v30.45,28.73 36.4,28.73 36.98,28.14 36.98,26.95 T3.C | v25.86,41.05 34.52,41.05 35.56,42.09 v44.48,42.09
N$28  (via drill 0.6)
  Top 0.406: 18.87,10.62 18.87,15.9 20.34,17.37 27.43,17.37 28.78,18.72 28.78,23.9 28.35,24.33 26.13,24.33 R24.2 21.13,24.17 R23.2 21.01,24.89 18.72,27.18
  Top 0.61: 18.87,10.62 X6.1 | X16.1 17.75,30.25 18.77,29.23 18.77,27.76 J10.3 18.72,27.51 18.72,27.18 18.77,27.23 | v22.68,38.66 22.68,58.65 C2.+
  Top 0.813: C2.+ 23.14,59.16 19.89,59.16 17.96,61.09 12.24,61.09 11.58,61.75 3.3,61.75 2.08,62.97 2.08,75.13 2.77,75.82 IC1.OUT
  Bottom 0.406: 18.77,27.76 J10.3
  Bottom 0.61: J14.3 17.22,11.53 X6.1 | 18.77,27.76 18.77,29.39 19.56,30.18 22.94,30.18 23.75,30.99 23.75,37.59 v22.68,38.66
  Bottom 0.813: X6.1 18.5,8.14 20.24,6.4 39.75,6.4 40.74,7.39 40.74,10.12 X5.1 40.77,7.72 42.09,6.4 61.11,6.4 62.89,8.18 62.89,10.07 X4.1 62.97,9.39 65.43,6.93 79.48,6.93 80.49,7.95 80.49,13.21 81.99,14.71 87.83,14.71 X3.1
N$29
  Bottom 0.406: J4.1 57.48,20.95 57.48,22.66 56.69,23.44 54.61,23.44 53.06,24.99 R7.1 52.81,27.37 R8.2
N$30
  Bottom 0.406: T3.B 38.94,26.69 R6.1
N$31  (via drill 0.6)
  Top 0.406: J11.9 52.35,38.58 52.88,39.12 62.99,39.12 64.29,40.41 66.7,40.41 67.56,41.27 67.56,47.7 v67.51,47.75
  Bottom 0.406: v67.51,47.75 65.3,47.75 R4.2
N$32  (via drill 0.6)
  Top 0.406: J11.8 49.73,36.22 49.73,38.43 49.17,38.99 49.12,38.99 47.93,40.18 47.93,40.92 v47.88,40.97
  Bottom 0.406: T5.E 80.72,65.66 81.81,64.57 81.81,57.35 78.16,53.7 77.62,53.7 77.6,53.67 63.25,53.67 61.49,51.92 61.49,50.9 59.72,49.12 45.77,49.12 44.81,48.16 44.81,48.13 44.04,47.37 44.04,45.14 45.13,44.05 R5.2 46.01,42.84 v47.88,40.97
N$33
  Bottom 0.406: J11.7 47.32,36.09 47.32,34.29 41.6,28.57 R6.2
N$34
  Bottom 0.813: J6.1 13.82,27.69 J10.1
N$35  (via drill 0.6)
  Top 0.406: X9.23 47.66,55.28 v47.65,55.27 | v28.3,53.49 27.46,53.49 27.15,53.8 | 27.15,53.8 25.68,52.32 25.68,47.08 R11.2 | 27.15,53.8 R14.1
  Bottom 0.406: v47.65,55.27 46.86,55.27 45.7,54.1 38.38,54.1 37.44,53.16 | 37.44,53.16 37.44,50.93 J8.3 37.39,48.72 36.02,47.35 36.02,44.97 U$1.4 | 37.44,53.16 37.44,53.21 36.7,53.95 33.96,53.95 33.5,53.49 v28.3,53.49
N$36
  Top 0.813: J7.1 59.89,85.53 K1.NO 48.7,85.72 D2.A
N$37
  Bottom 0.406: R18.2 78.35,69.05 77.5,68.2 77.5,65.71 T5.B
N$38  (1 unrouted)
  Top 0.61: T4.1 39.04,80.64 40.21,81.81 40.21,88.72 39.29,89.64 2.64,89.64 1.35,88.34 1.35,79.02 2.62,77.75 8.13,77.75 8.71,77.17 8.71,74.14 8.69,74.12
  Bottom 1.016: IC1.IN 7.77,70.74 8.69,71.65 8.69,74.6 C3.+
N$39  (via drill 0.6)
  Top 0.406: 75.82,71.86 76.35,71.32 76.35,64.8 75.34,63.78 50.72,63.78 49.68,62.74 49.68,58.22 51.18,56.72 57.94,56.72 58.78,55.88 58.78,49.15 58.37,48.74 45.87,48.74 44.6,47.47 R9.2 | 75.82,71.86 75.74,71.93 | 57.48,72.8 v57.53,72.75 57.23,72.44 39.12,72.44 v38.48,73.08 | v67.84,71.86 75.82,71.86
  Top 1.016: T4.3 37.11,84.99
  Bottom 0.406: v57.53,72.75 57.53,72.67 58.27,71.93 67.77,71.93 v67.84,71.86 | v38.48,73.08 38.48,78.08 37.49,79.07 35.61,79.07 34.87,79.81 34.87,84.78 35.31,85.22 T4.3
N$40
  Top 0.305: 42.24,36.2 J11.5
  Bottom 0.406: J11.5 42.16,36.12 42.16,34.16 41.22,33.22 29.23,33.22 28.19,32.18 28.19,25.63 27.48,24.92 11.3,24.92 9.96,26.26 9.96,45.74 8.41,47.3 X13.2
N$41
  Bottom 0.406: X9.18 40.04,70.34 38.76,71.63 37.36,71.63 36.85,72.14 36.85,76.3 33.66,79.5 33.66,88.54 32.26,89.94 32.26,93.12 X15.2
N$42  (via drill 0.6)
  Top 0.305: R17.2 30.23,46.51 31.67,47.95 31.67,50.24 J8.5 32.28,50.9 32.28,54.62 R16.1 32.25,54.69 33.45,54.69 34.09,55.32 34.09,60.71 32.42,62.37 X9.11
  Top 0.406: 32.28,54.62 30.39,54.62 v30.3,54.71 | 64.26,59 v64.26,59.41 61.42,56.57 v60.17,56.57
  Bottom 0.305: J8.5 32.31,45.14 U$1.6
  Bottom 0.406: U$2.RST 53.61,63.34 54.3,64.03 63.55,64.03 64.24,63.35 64.24,59.44 v64.26,59.41 | v30.3,54.71 32.31,54.71 32.97,55.37 44.86,55.37 46.15,56.67 60.07,56.67 v60.17,56.57
N$44
  Top 0.305: 39.69,50.63 J8.2 39.93,52.7 R15.1
  Top 0.406: X9.19 42.58,64.43 43.99,63.02 43.99,62.99 44.35,62.64 44.35,55.02 42.75,53.42 40.63,53.42 R15.1 | 39.85,46.26 R10.2 39.57,50.52 J8.2
  Bottom 0.305: 38.12,44.96 U$1.3 38.08,47.35 39.93,49.2 J8.2
N$45
  Top 0.305: R17.1 30.23,40.54 29.01,39.32 29.01,33.45 30.43,32.03 38,32.03 39.62,33.66 39.62,36.12 J11.4
N$46  (via drill 0.6)
  Top 0.406: X9.12 32.42,70.37 32.94,70.89 68.91,70.89 v69.7,70.1
  Bottom 0.406: X11.1 87.42,77.1 C4.1 80.74,77.09 78.72,77.09 | v69.7,70.1 69.7,75.62 71.17,77.09 78.72,77.09 | R18.1 79.87,71.13 78.21,72.8 78.21,76.58 78.72,77.09
N$47  (via drill 0.6)
  Top 0.406: v25.6,61.49 24.94,60.83 20.04,60.83 18.64,62.23 12.88,62.23 10.95,64.16 X10.1
  Top 0.61: 25.25,61.85 v25.6,61.49
  Bottom 0.61: v25.6,61.49 27.49,61.49 U$1.9
N$48
  Top 0.305: 34.95,48.97 34.95,50.77 J8.4 | 34.8,50.93 J8.4 | J8.4 34.9,50.93 34.9,52.35 36.12,53.57 R13.1 36.13,54.71 37.24,54.71 38.08,55.55 38.08,60.78 37.5,61.35 X9.15
  Top 0.406: 34.95,48.97 34.95,48.24 R12.2
  Bottom 0.305: U$1.5 34.08,49.09 34.87,49.89 34.87,50.85 J8.4
N$49
  Top 0.305: J12.5 67.59,33.25 65.53,31.19 65.53,28.09 66.22,27.41 67.7,27.41 R19.2
N$50
  Top 0.305: J4.3 62.51,27.7 R21.1
N$51
  Top 0.406: X9.3 22.26,66.26 22.12,66.12
  Bottom 0.406: 22.3,66.23 X9.3 | 21.95,65.95 X9.3 | J9.2 19.48,55.14 20.27,55.93 20.27,61.24 21.69,62.66 21.69,65.69 X9.3
N$52  (via drill 0.6)
  Top 0.406: 24.79,66.25 X9.5 24.89,66.18 24.89,65.25 23.65,64.01 v20.5,64.01
  Bottom 0.406: J9.1 18.64,57.68 19.38,58.42 19.38,62.89 v20.5,64.01
N$53  (via drill 0.6)
  Top 0.406: IC2.4 17.58,38.56 17.88,38.86 17.88,47.37 v17.91,47.4
  Bottom 0.406: 36.07,63.42 35.51,63.98 35.48,63.96 23.47,63.96 22.76,63.25 22.76,61.82 21.26,60.33 21.26,52.58 20.83,52.15 18.54,52.15 17.86,51.46 17.86,47.45 v17.91,47.4 18.82,48.31 29.26,48.31 29.77,48.82 J8.6 | 36.07,63.42 36.07,60.92 U$1.13 | U$2.VCC 51.07,63 49.99,64.08 47.32,64.08 | 47.32,64.08 36.73,64.08 36.07,63.42 | R22.2 47.8,63.6 47.32,64.08
N$54  (via drill 0.6)
  Top 0.406: R2.1 50.84,27.64 R3.2 56.03,27.8 R1.2 59.76,27.86 59.97,28.07 | J4.2 59.97,28.07 | 59.97,28.07 59.97,28.35 61.34,29.72 62.39,29.72 R21.2 62.37,29.74 62.37,29.75 v65,32.38
  Top 0.61: J5.3 29.72,72.7 28.65,71.63 11.94,71.63 10.67,70.36 10.67,69.34 v8.59,67.26
  Top 0.813: K1.1 72.36,81.72 K1.C | K3.C 75.19,42.77 K3.1 | X13.1 6.2,52.38 11.2,47.37 12.71,47.37 IC2.3 | v34.67,73.15 36.47,74.95 39.57,74.95 40.31,74.22 40.31,74.17 J1.6 42.77,74.02 45.49,74.02 45.8,74.32 45.8,78.38 44.93,79.25 J1.4
  Bottom 0.406: T5.C 79.05,66.7 79.5,67.16 89.99,67.16 91.16,65.99 | v65,32.38 68.1,32.38 69.09,33.38 69.09,42.14 69.7,42.75 71.17,42.75 K3.C
  Bottom 0.61: v8.59,67.26 8.59,66.17 9.35,65.41 9.35,54.69 7.04,52.38 X13.1
  Bottom 0.813: 73.94,79.3 56.57,79.3 55.6,78.33 55.6,71.86 54.48,70.74 47.37,70.74 44.07,74.04 42.75,74.04 J1.6 | 73.94,79.3 K1.C | 73.94,79.3 90.14,79.3 91.16,78.28 91.16,65.99 91.16,55.04 90.42,54.3 87.79,54.3 X2.1 82.38,54.34 77.11,49.07 77.11,44.85 K3.1 | X13.1 5.28,52.38 2.03,49.12 2.03,14.15 3.2,12.98 8.1,12.98 9.32,11.76 9.32,9.86 10.08,9.09 12.47,9.09 J14.2 | v34.67,73.15 30.12,73.15 29.62,73.66 29.62,75.58 J5.3
N$55
  Bottom 0.406: X14.2 54.56,88.67 53.8,87.91 51.28,87.91 50.27,86.89 50.27,84.84 48.97,83.54 48.97,80.85 49.68,80.14 51.54,80.14 J13.2
N$56
  Bottom 0.406: X14.3 49.48,88.42 48.84,87.78 47.24,87.78 46.53,87.07 46.53,78.99 47.65,77.88 51.82,77.88 J13.3
N$59
  Top 0.406: 37.57,68.87 X9.16 | 37.52,68.82 X9.16 | X9.16
  Bottom 0.406: X9.16 37.52,68.82 37.52,70.23 37.03,70.71 36.45,70.71 35.79,71.37 35.79,75.97 32.18,79.58 32.18,88.24 30.76,89.66 27.58,89.66 27.03,90.22 27.03,93.12 X15.3
N$61
  Top 0.406: J11.2 34.57,37.08 36.6,39.12 38.76,39.12 39.57,39.93 R10.1
  Bottom 0.406: J6.3 18.9,39.95 19.18,40.23 23.04,40.23 24.82,38.46 33.35,38.46 34.65,37.16 34.65,36.22 J11.2 | 34.8,36.98 34.8,36.37 J11.2 | 34.57,37.08 J11.2
N$62  (via drill 0.6)
  Top 0.406: J9.3 17.17,52.6 17.7,53.14 17.7,59.05 v17.68,59.08
  Bottom 0.406: v17.68,59.08 17.68,64.22 X9.1 19.48,66.03
N$63
  Bottom 0.406: 53.72,59.73 U$2.GPIO0 52.19,58.42 49.07,58.42 48.09,59.4 R22.1
N$64
  Top 0.406: R23.1 19.67,22.39 17.22,24.84 6.4,24.84 X16.2
  Bottom 0.406: X16.2 7.09,25.17 9.35,22.91 29.29,22.91 29.29,22.96 30.45,24.13 51.18,24.13 52.38,22.94 52.38,20.93 J3.9 52.35,20.22 54.94,17.63 54.94,15.62 55.35,15.21 56.83,15.21 C9.2 57.13,15.26 58.8,13.59 66.4,13.59 68.12,11.86 68.12,10.22 X4.2
N$69  (via drill 3.2)  (4 unrouted)
  other vias: 75.03,35.94 10.39,95.2 58.24,43.79 88.95,88.06 83.95,8.43
N$70
  Top 0.61: X9.2 19.72,69.94 20.14,70.36 29.62,70.36 32.38,73.13 32.38,75.56 J5.4
  Top 0.813: 32.33,75.61 J5.4 32.26,77.86 33.27,78.87 38.08,78.87 40.13,76.81 42.52,76.81 J1.5
  Top 1.016: X1.1 82.3,64.44 77.19,59.33 K3.NO
  Bottom 0.813: 53.8,72.95 53.8,83.44 59.23,88.88 81.15,88.88 82.3,90.02 X1.1
  Bottom 1.016: J1.5 44.04,76.71 48.41,72.34 53.19,72.34 53.8,72.95

### Text on the board
Top: wimarc04
tTest: 12